# Altium schematic sheet Dual_Flowmeter_Interface.SchDoc
size A; SheetNumber: 14; SheetTotal: 16
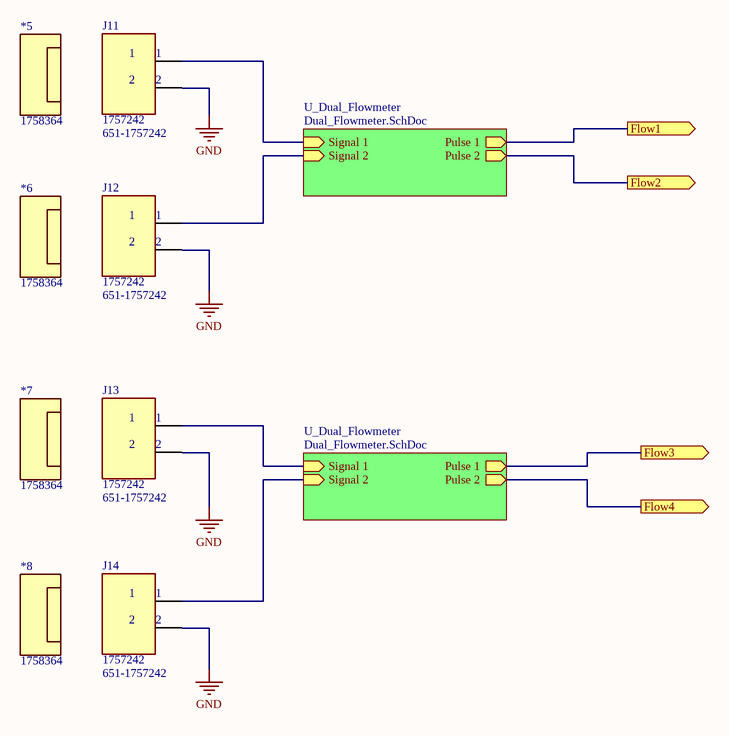
[diagram p0: Dual_Flowmeter_Interface.SchDoc]

## Parts
*5  1758364  [Connector_1758364]
*6  1758364  [Connector_1758364]
*7  1758364  [Connector_1758364]
*8  1758364  [Connector_1758364]
J11  1757242  Supplier Part Number 1: 651-1757242  [PHOENIX_1757242]
J12  1757242  Supplier Part Number 1: 651-1757242  [PHOENIX_1757242]
J13  1757242  Supplier Part Number 1: 651-1757242  [PHOENIX_1757242]
J14  1757242  Supplier Part Number 1: 651-1757242  [PHOENIX_1757242]

## Sub-sheets
U_Dual_Flowmeter = Dual_Flowmeter.SchDoc: Pulse 1 (out), Signal 1 (in), Pulse 2 (out), Signal 2 (in)
U_Dual_Flowmeter = Dual_Flowmeter.SchDoc: Pulse 1 (out), Signal 1 (in), Pulse 2 (out), Signal 2 (in)

## Ports
Flow1 (out), Flow2 (out), Flow3 (out), Flow4 (out)

## Nets
Flow1: port Flow1, sheet U_Dual_Flowmeter/Pulse 1
Flow2: port Flow2, sheet U_Dual_Flowmeter/Pulse 2
Flow3: port Flow3, sheet U_Dual_Flowmeter/Pulse 1
Flow4: port Flow4, sheet U_Dual_Flowmeter/Pulse 2

## Notes on the sheet
- (in symbol 1757242) 1; 2

## Library data of the parts
*5-*8 = 1758364: Conn Terminal Block F 2 POS 5.08mm Screw RA Cable Mount 12A; Manufacturer: Phoenix Contact; Voltage Rating: 250V; Number of Positions: 2; Number of Levels: 1; Current: 15A; Voltage: 300V; Gender: Female; Wire Gauge (Max): 12AWG; Wire Gauge (Min): 24AWG; Stripping Length: 7mm; Supplier 1: Digi-Key; Manufacturer Part Number: 1758364; RoHS: Yes; Category: Terminal Blocks; Stock 1: 1385; Pricing 1: 1=2.18000, 10=2.11900, 50=1.98000, 100=1.82160, 250=1.68300, 500=1.60380, 1000=1.52460 (USD); Mount: Free Hanging,Plug-In; Contact Plating: Tin; Color: Green; Contact Material: Tin; Weight: 0.133336oz; Housing Color: Green; Current Rating: 12A; Package Quantity: 50; Max Current Rating: 12A; Packaging: Bulk; Termination: Screw; Number of Positions Per Level: 2; Number of Contacts: 2; Connector Type: Screw; Number of Rows: 1; Series: COMBICON MSTB; Number of Poles: 2; Length: 10.16mm; Width: 18.3mm; Height: 15mm; Pitch: 5.08mm; RoHS Compliant: Yes; ComponentLink1URL: https://datasheet.ciiva.com/796/1758364-796729.pdf?src-supplier=Digi-Key; ComponentLink1Description: https://datasheet.ciiva.com/796/1758364-796729.pdf?src-supplier=Digi-Key; ComponentLink2URL: https://datasheet.ciiva.com/16096/1758364-16096513.pdf?src-supplier=Onlinecomponents.com; ComponentLink2Description: https://datasheet.ciiva.com/16096/1758364-16096513.pdf?src-supplier=Onlinecomponents.com; ComponentLink3URL: https://datasheet.ciiva.com/14607/70055300-14607547.pdf?src-supplier=Allied+Electronics; ComponentLink3Description: https://datasheet.ciiva.com/14607/70055300-14607547.pdf?src-supplier=Allied+Electronics; ComponentLink4URL: https://datasheet.ciiva.com/29222/569586-da-01-en-steckerteil-1758364-50-st-29222742.pdf?src-supplier=Conrad; ComponentLink4Description: https://datasheet.ciiva.com/29222/569586-da-01-en-steckerteil-1758364-50-st-29222742.pdf?src-supplier=Conrad; Supplier Part Number 1: 277-1964-ND
J11-J14 = 1757242: 2 Position Terminal Block Header, Male Pins, Shrouded _4 Side_ 0.200 _5.08mm_ 90Â°, Right Angle Through Hole; MF: Phoenix Contact; Package: None; Digi-Key_Part_Number: 277-1106-ND; MP: 1757242; Digi-Key_Purchase_URL: https://www.digikey.ch/product-detail/en/phoenix-contact/1757242/277-1106-ND/260474?utm_source=snapeda&utm_medium=aggregator&utm_campaign=symbol; Value: *; SnapEDA_Link: https://www.snapeda.com/parts/1757242/Phoenix%20Contact/view-part/228512/?ref=snap; Supplier 1: Mouser